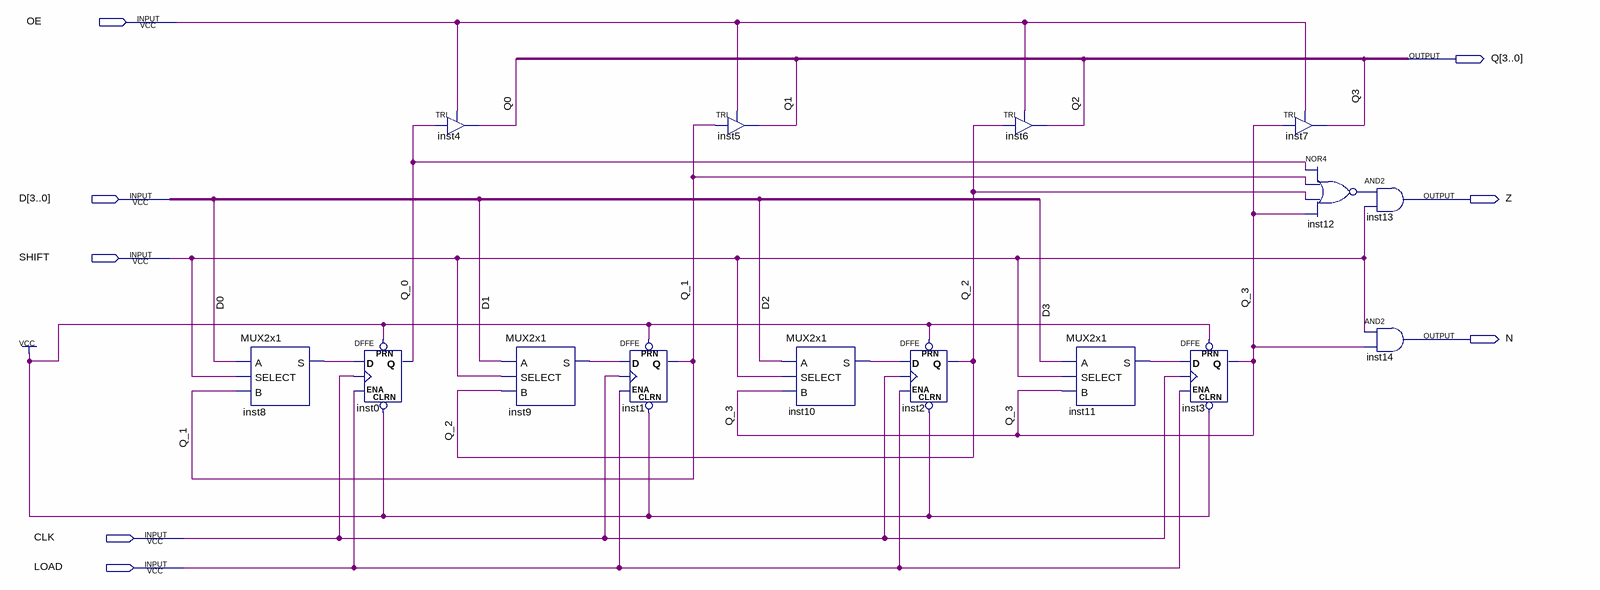
[diagram p0: schematic sheet]
// Quartus schematic REG4_ASR.bdf as structural Verilog: 15 symbols, 8 pins
module REG4_ASR (
  input  OE,
  input  [3:0] D,
  input  SHIFT,
  input  CLK,
  input  LOAD,
  output [3:0] Q,
  output Z,
  output N
);

  wire inst8_s, inst9_s, inst10_s, inst11_s, inst12_out, Q_0, Q_1, Q_2, Q_3;

  MUX2x1 inst8 (.A(D[0]), .SELECT(SHIFT), .B(Q_1), .S(inst8_s));
  DFFE inst0 (.PRN(1'b1), .CLRN(1'b1), .D(inst8_s), .CLK(CLK), .ENA(LOAD), .Q(Q_0));
  TRI inst4 (.IN(Q_0), .OE(OE), .OUT(Q[0]));
  MUX2x1 inst9 (.A(D[1]), .SELECT(SHIFT), .B(Q_2), .S(inst9_s));
  DFFE inst1 (.PRN(1'b1), .CLRN(1'b1), .D(inst9_s), .CLK(CLK), .ENA(LOAD), .Q(Q_1));
  TRI inst5 (.IN(Q_1), .OE(OE), .OUT(Q[1]));
  MUX2x1 inst10 (.A(D[2]), .SELECT(SHIFT), .B(Q_3), .S(inst10_s));
  DFFE inst2 (.PRN(1'b1), .CLRN(1'b1), .D(inst10_s), .CLK(CLK), .ENA(LOAD), .Q(Q_2));
  TRI inst6 (.IN(Q_2), .OE(OE), .OUT(Q[2]));
  MUX2x1 inst11 (.A(D[3]), .SELECT(SHIFT), .B(Q_3), .S(inst11_s));
  DFFE inst3 (.PRN(1'b1), .CLRN(1'b1), .D(inst11_s), .CLK(CLK), .ENA(LOAD), .Q(Q_3));
  TRI inst7 (.IN(Q_3), .OE(OE), .OUT(Q[3]));
  nor inst12 (inst12_out, Q_0, Q_1, Q_2, Q_3);
  and inst13 (Z, inst12_out, SHIFT);
  and inst14 (N, SHIFT, Q_3);
endmodule
